# Altium project PCB_Project3.PrjPCB
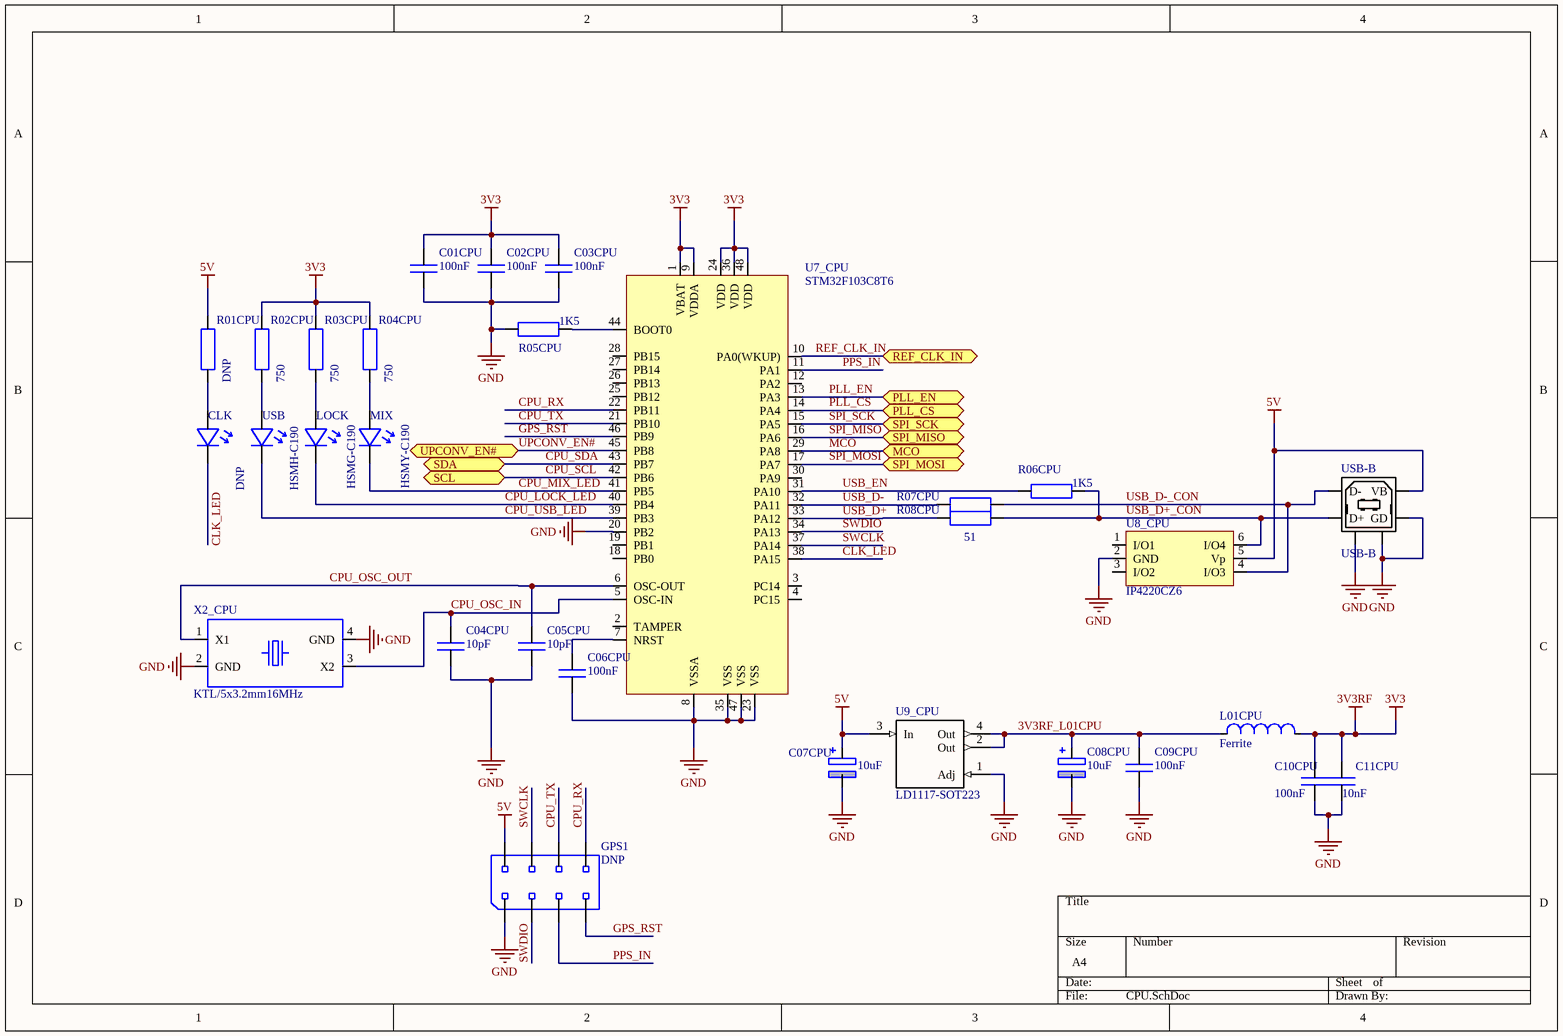
[diagram p0: CPU.SchDoc]
3 sheets, 155 parts. Net scope: flat (ports and power ports of the same name join across sheets).
Board file: Template2.PcbDoc
Sheets:
  CPU.SchDoc
  LO.SchDoc
  Mixer.SchDoc

## Sheet CPU.SchDoc
size A4

### Parts
C01CPU  100nF  [smd C0603_0.80]
C02CPU  100nF  [smd C0603_0.80]
C03CPU  100nF  [smd C0603_0.80]
C04CPU  10pF  [smd C0603_0.80]
C05CPU  10pF  [smd C0603_0.80]
C06CPU  100nF  [smd C0603_0.80]
C07CPU  10uF  [smd C1206 polar]
C08CPU  10uF  [smd C1206 polar]
C09CPU  100nF  [smd C0603_0.80]
C10CPU  100nF  [smd C0603_0.80]
C11CPU  10nF  [smd C0603_0.80]
CLK  DNP  [led HSMH-C190 (Avago Technologies)]
GPS1  DNP  [hdr 2x4]
L01CPU  Ferrite  [smd C0805]
LOCK  HSMG-C190  [led HSMH-C190 (Avago Technologies)]
MIX  HSMY-C190  [led HSMH-C190 (Avago Technologies)]
R01CPU  DNP  [smd C0603_0.45]
R02CPU  750  [smd C0603_0.45]
R03CPU  750  [smd C0603_0.45]
R04CPU  750  [smd C0603_0.45]
R05CPU  1K5  [smd C0603_0.45]
R06CPU  1K5  [smd C0603_0.45]
R07CPU  51  [smd C0603_0.45]  (value not drawn)
R08CPU  51  [smd C0603_0.45]
U7_CPU  STM32F103C8T6  [TSQFP50P900X900X160-48N]
U8_CPU  IP4220CZ6  [smd SOT-457]
U9_CPU  LD1117-SOT223  [SOT223]
USB  HSMH-C190  [led HSMH-C190 (Avago Technologies)]
USB-B  USB-B  [USB-B]
X2_CPU  KTL/5x3.2mm16MHz  [smd KTL 5x3.2]

### Ports
MCO, PLL_CS, PLL_EN, REF_CLK_IN, SCL, SDA, SPI_MISO, SPI_MOSI, SPI_SCK, UPCONV_EN#

### Nets
3V3: C01CPU.2 C02CPU.2 C03CPU.2 C10CPU.2 C11CPU.2 L01CPU.2 R02CPU.2 R03CPU.2 R04CPU.2 U7_CPU.1(VBAT) U7_CPU.9(VDDA) U7_CPU.24(VDD) U7_CPU.36(VDD) U7_CPU.48(VDD)  [also labelled 3V3RF]
5V: C07CPU.1 GPS1.2 R01CPU.2 U8_CPU.5(Vp) U9_CPU.3(In) USB-B.1(VB)
GND: C01CPU.1 C02CPU.1 C03CPU.1 C04CPU.1 C05CPU.1 C06CPU.1 C07CPU.2 C08CPU.2 C09CPU.1 C10CPU.1 C11CPU.1 GPS1.1 R05CPU.1 U7_CPU.8(VSSA) U7_CPU.20(PB2) U7_CPU.23(VSS) U7_CPU.35(VSS) U7_CPU.47(VSS) U8_CPU.2(GND) U9_CPU.1(Adj) USB-B.4(GD) USB-B.5 USB-B.6 X2_CPU.2(GND) X2_CPU.4(GND)
3V3RF_L01CPU: C08CPU.1 C09CPU.2 L01CPU.1 U9_CPU.2(Out) U9_CPU.4(Out)
CLK_LED: CLK.2 U7_CPU.38(PA15)
CPU_LOCK_LED: LOCK.2 U7_CPU.40(PB4)
CPU_MIX_LED: MIX.2 U7_CPU.41(PB5)
CPU_OSC_IN: C04CPU.2 U7_CPU.5(OSC-IN) X2_CPU.3(X2)
CPU_OSC_OUT: C05CPU.2 U7_CPU.6(OSC-OUT) X2_CPU.1(X1)
CPU_RX: GPS1.8 U7_CPU.22(PB11)
CPU_SCL: U7_CPU.42(PB6) ; port SCL
CPU_SDA: U7_CPU.43(PB7) ; port SDA
CPU_TX: GPS1.6 U7_CPU.21(PB10)
CPU_USB_LED: U7_CPU.39(PB3) USB.2
GPS_RST: GPS1.7 U7_CPU.46(PB9)
MCO: U7_CPU.29(PA8) ; port MCO
PLL_CS: U7_CPU.14(PA4) ; port PLL_CS  [project net CS_PLL]
PLL_EN: U7_CPU.13(PA3) ; port PLL_EN
PPS_IN: GPS1.5 U7_CPU.11(PA1)
REF_CLK_IN: U7_CPU.10(PA0(WKUP)) ; port REF_CLK_IN
SPI_MISO: U7_CPU.16(PA6) ; port SPI_MISO
SPI_MOSI: U7_CPU.17(PA7) ; port SPI_MOSI
SPI_SCK: U7_CPU.15(PA5) ; port SPI_SCK
SWCLK: GPS1.4 U7_CPU.37(PA14)
SWDIO: GPS1.3 U7_CPU.34(PA13)
UPCONV_EN#: U7_CPU.45(PB8) ; port UPCONV_EN#
USB_D+: R08CPU.1 U7_CPU.33(PA12)
USB_D+_CON: R06CPU.2 R08CPU.2 U8_CPU.6(I/O4) USB-B.3(D+)
USB_D-: R07CPU.1 U7_CPU.32(PA11)
USB_D-_CON: R07CPU.2 U8_CPU.4(I/O3) USB-B.2(D-)
USB_EN: R06CPU.1 U7_CPU.31(PA10)
NetC06CPU_2: C06CPU.2 U7_CPU.7(NRST)
NetCLK_1: CLK.1 R01CPU.1
NetLOCK_1: LOCK.1 R03CPU.1
NetMIX_1: MIX.1 R04CPU.1
NetR02CPU_1: R02CPU.1 USB.1
NetR05CPU_2: R05CPU.2 U7_CPU.44(BOOT0)

Not connected (* = marked no-connect by the designer): U7_CPU 2(TAMPER) 3(PC14) 4(PC15) 12(PA2) 18(PB0) 19(PB1) 25(PB12) 26(PB13) 27(PB14) 28(PB15) 30(PA9); U8_CPU 1(I/O1) 3(I/O2)

### Library data of the parts
C01CPU C02CPU C03CPU C06CPU C09CPU C10CPU C11CPU = CSMD603/100nF: smd capaciteit, verp.0603, 100nF; Part Number: CSMD603/100nF; Component Kind: Standard; Component Type: Standard; Designator: CSMD603/100nF; Pin Count: 2; Supplier 1: Farnell
C04CPU C05CPU = CSMD603/10pF: smd capaciteit, verp.0603, 10pF; Part Number: CSMD603/10pF; Component Kind: Standard; Component Type: Standard; Designator: CSMD603/10pF; Pin Count: 2; Supplier 1: Farnell
C07CPU C08CPU = CSMD1206/10uF/10V: smd capaciteit, tantalium, verp.1206, 10uF/10V; Part Number: CSMD1206/10uF/10V; Component Kind: Standard; Component Type: Standard; Designator: CSMD1206/10uF/10V; Pin Count: 2; Supplier 1: Farnell
CLK USB = HSMH-C190: led smd rood, Avago Techn., HSMH-C190; Supplier 1: Farnell
GPS1 = CON HDR 2x4: pcb header recht 2x4  pitch 100mil; Part Number: CON HDR 2x4; Component Kind: Standard; Component Type: Standard; Designator: CON HDR 2x4; Pin Count: 8; Supplier 1: Farnell
L01CPU = Ferrite 0805: Ferrite bead, 0805 package; Supplier 1: Farnell
LOCK = HSMG-C190: led smd groen, Avago Techn., HSMG-C190; Supplier 1: Farnell
MIX = HSMY-C190: led smd geel, Avago Techn., HSMY-C190; Supplier 1: Farnell
R01CPU R02CPU R03CPU R04CPU = 470R/603: weerstand SMD603, 470R; Supplier 1: Farnell
R05CPU R06CPU = 1K5/603: weerstand SMD603, 1K5; Supplier 1: Farnell
R07CPU R08CPU = 22R/603: weerstand SMD603, 22R; Supplier 1: Farnell
U7_CPU = STM32F100xx
U8_CPU = IP4220CZ6: Dual USB 2.0 integrated ESD protection; Supplier 1: Farnell
USB-B = USB-B: USB B DEVICE CONNECTOR; Text Field1: Assmann; Text Field2: AU-Y1007; Text Field3: Digi-Key; Text Field4: AE1085-ND; Text Field5: Thru-Hole; Text Field6: 1.168; NI?: *; O?: *; Section:: *
X2_CPU = KTL/5x3.2mm 16MHz: TXC Xtal 16.000 MHz, 5x3.2mm; Part Number: KTL/5x3.2mm 16MHz; Component Kind: Standard; Component Type: Standard; Designator: KTL/5x3.2mm 16MHz; Pin Count: 4; Supplier 1: Farnell

## Sheet LO.SchDoc
size A4
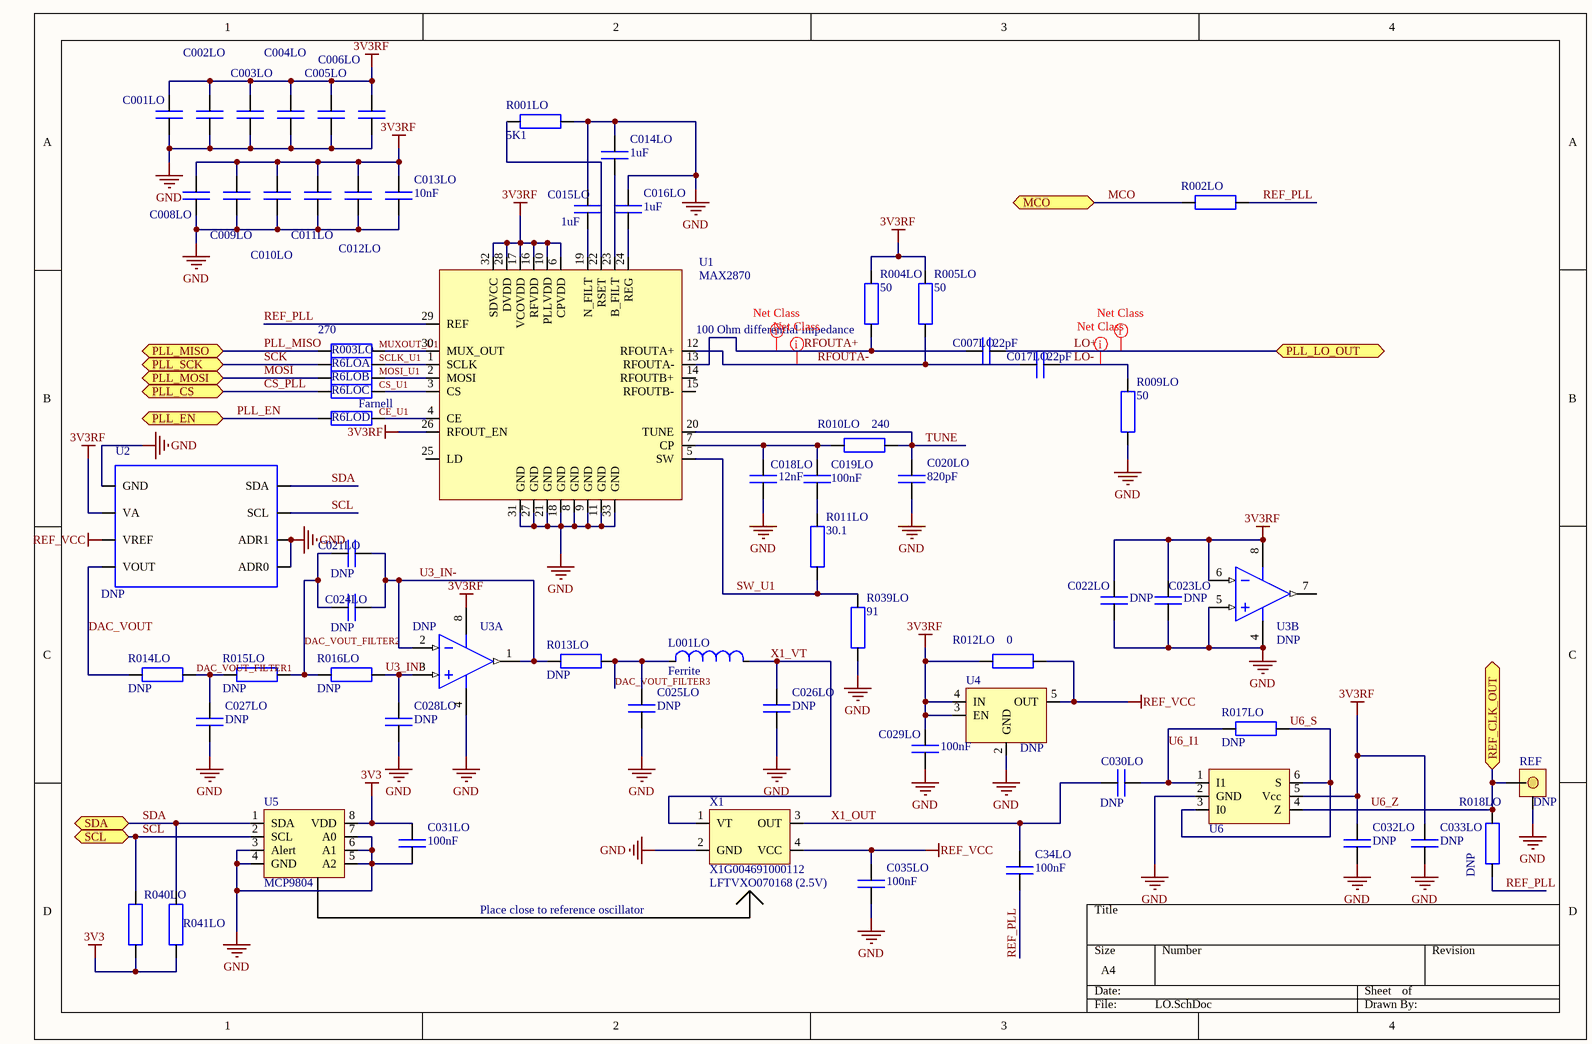
[diagram p1: LO.SchDoc]

### Parts
C001LO  100nF  [smd C0603_0.80]  (value not drawn)
C002LO  100nF  [smd C0603_0.80]  (value not drawn)
C003LO  100nF  [smd C0603_0.80]  (value not drawn)
C004LO  100nF  [smd C0603_0.80]  (value not drawn)
C005LO  100nF  [smd C0603_0.80]  (value not drawn)
C006LO  100nF  [smd C0603_0.80]  (value not drawn)
C007LO  22pF  [smd C0402]
C008LO  10nF  [smd C0402]  (value not drawn)
C009LO  10nF  [smd C0402]  (value not drawn)
C010LO  10nF  [smd C0402]  (value not drawn)
C011LO  10nF  [smd C0402]  (value not drawn)
C012LO  10nF  [smd C0402]  (value not drawn)
C013LO  10nF  [smd C0402]
C014LO  1uF  [smd C0603_0.80]
C015LO  1uF  [smd C0603_0.80]
C016LO  1uF  [smd C0603_0.80]
C017LO  22pF  [smd C0402]
C018LO  12nF  [smd C0603_0.80]
C019LO  100nF  [smd C0603_0.80]
C020LO  820pF  [smd C0603_0.80]
C021LO  DNP  [smd C0805_1.30]
C022LO  DNP  [smd C0402]
C023LO  DNP  [smd C0603_0.80]
C024LO  DNP  [smd C0805_1.30]
C025LO  DNP  [smd C0805_0.60]
C026LO  DNP  [smd C0805_0.60]
C027LO  DNP  [smd C0805_1.30]
C028LO  DNP  [smd C0805_0.60]
C029LO  100nF  [smd C0603_0.80]
C030LO  DNP  [smd C0603_0.80]
C031LO  100nF  [smd C0603_0.80]
C032LO  DNP  [smd C0603_0.80]
C033LO  DNP  [smd C0603_0.80]
C34LO  100nF  [smd C0603_0.80]
C035LO  100nF  [smd C0603_0.80]
L001LO  Ferrite  [smd C0805]
R001LO  5K1  [smd C0603_0.45]
R002LO  (no value)  [smd C0805_0.50]
R003LO  270  [smd C0805_0.50]
R004LO  50  [smd C0402_0.35]
R005LO  50  [smd C0402_0.35]
R6LO  DNP  [smd R EXB38v]  (value not drawn)  (parts A,B,C,D of 4)
R009LO  50  [smd C0402_0.35]
R010LO  240  [smd C0603_0.45]
R011LO  30.1  [smd C0603_0.45]
R012LO  0  [smd C0805_0.50]
R013LO  DNP  [smd C0603_0.45]
R014LO  DNP  [smd C0603_0.45]
R015LO  DNP  [smd C0603_0.45]
R016LO  DNP  [smd C0603_0.45]
R017LO  DNP  [smd C0603_0.45]
R018LO  DNP  [smd C0805_0.50]
R039LO  91  [smd C0603_0.45]
R040LO  (no value)  [smd C0805_0.50]
R041LO  (no value)  [smd C0805_0.50]
REF  DNP  [smd U.FL]
U1  MAX2870  [MAXIM-T3255]
U2  DNP  [smd MSOP/8]
U3  DNP  [smd soicn/8]  (parts A,B of 2)
U4  DNP  [SO23-5 TI]
U5  MCP9804  [smd MSOP/8]
U6  DNP  [SMD SC-70 (6-pin)]  (value not drawn)
X1  X1G004691000112  [X1G004691000112]

### Ports
MCO, PLL_CS, PLL_EN, PLL_LO_OUT, PLL_MISO, PLL_MOSI, PLL_SCK, REF_CLK_OUT, SCL, SDA

### Nets
3V3: C001LO.2 C002LO.2 C003LO.2 C004LO.2 C005LO.2 C006LO.2 C008LO.2 C009LO.2 C010LO.2 C011LO.2 C012LO.2 C013LO.2 C022LO.2 C023LO.2 C029LO.2 C031LO.2 C032LO.2 C033LO.2 R004LO.2 R005LO.2 R012LO.1 R040LO.2 R041LO.1 U1.6(CPVDD) U1.10(PLLVDD) U1.16(RFVDD) U1.17(VCOVDD) U1.26(RFOUT_EN) U1.28(DVDD) U1.32(SDVCC) U2.6(VA) U3.6(IN-) U3.8(V+) U4.3(EN) U4.4(IN) U5.8(VDD) U6.5(Vcc)  [also labelled 3V3RF]
GND: C001LO.1 C002LO.1 C003LO.1 C004LO.1 C005LO.1 C006LO.1 C008LO.1 C009LO.1 C010LO.1 C011LO.1 C012LO.1 C013LO.1 C014LO.1 C015LO.1 C016LO.1 C018LO.1 C020LO.1 C022LO.1 C023LO.1 C025LO.1 C026LO.1 C027LO.1 C028LO.1 C029LO.1 C031LO.1 C032LO.1 C033LO.1 C035LO.1 R001LO.1 R009LO.1 R039LO.1 REF.0 U1.8(GND) U1.9(GND) U1.11(GND) U1.18(GND) U1.21(GND) U1.27(GND) U1.31(GND) U1.33(GND) U2.1(ADR0) U2.2(ADR1) U2.5(GND) U3.4(V-) U3.5(IN+) U4.2(GND) U5.3(Alert) U5.4(GND) U5.5(A2) U5.6(A1) U5.7(A0) U6.2(GND) X1.2(GND)
REF_VCC: C035LO.2 R012LO.2 U2.7(VREF) U4.5(OUT) X1.4(VCC)
CS_PLL: R6LO.5 ; port PLL_CS
DAC_VOUT: R014LO.1 U2.8(VOUT)
DAC_VOUT_FILTER1: C027LO.2 R014LO.2 R015LO.1
DAC_VOUT_FILTER2: C021LO.2 C024LO.2 R015LO.2 R016LO.1
DAC_VOUT_FILTER3: C025LO.2 L001LO.1 R013LO.2
LO+: C007LO.2 ; port PLL_LO_OUT
LO-: C017LO.2 R009LO.2
MCO: R002LO.2 ; port MCO
MOSI: R6LO.3 ; port PLL_MOSI
PLL_EN: R6LO.7 ; port PLL_EN
PLL_MISO: R003LO.1 ; port PLL_MISO
REF_PLL: C34LO.2 R002LO.1 R018LO.1 U1.29(REF)
RFOUTA+: C007LO.1 R004LO.1 U1.13(RFOUTA-)
RFOUTA-: C017LO.1 R005LO.1 U1.12(RFOUTA+)
SCK: R6LO.1 ; port PLL_SCK
SCL: R040LO.1 U2.3(SCL) U5.2(SCL) ; port SCL  [project net CPU_SCL]
SDA: R041LO.2 U2.4(SDA) U5.1(SDA) ; port SDA  [project net CPU_SDA]
SW_U1: R011LO.1 R039LO.2 U1.5(SW)
TUNE: C020LO.2 R010LO.2 U1.20(TUNE)
U3_IN-: C021LO.1 C024LO.1 R013LO.1 U3.1(OUT) U3.2(IN-)
U3_INP: C028LO.2 R016LO.2 U3.3(IN+)
U6_I1: C030LO.1 R017LO.1 U6.1(I1)
U6_S: R017LO.2 U6.3(I0) U6.6(S)
U6_Z: R018LO.2 REF.1 U6.4(Z) ; port REF_CLK_OUT
X1_OUT: C030LO.2 C34LO.1 X1.3(OUT)
X1_VT: C026LO.2 L001LO.2 X1.1(VT)
NetC014LO_2: C014LO.2 U1.23(B_FILT)
NetC015LO_2: C015LO.2 U1.19(N_FILT)
NetC016LO_2: C016LO.2 U1.24(REG)
NetC018LO_2: C018LO.2 C019LO.2 R010LO.1 U1.7(CP)
NetC019LO_1: C019LO.1 R011LO.2
NetR001LO_2: R001LO.2 U1.22(RSET)
NetR003LO_2: R003LO.2 U1.30(MUX_OUT)
NetR6LO_2: R6LO.2 U1.1(SCLK)
NetR6LO_4: R6LO.4 U1.2(MOSI)
NetR6LO_6: R6LO.6 U1.3(CS)
NetR6LO_8: R6LO.8 U1.4(CE)

Not connected (* = marked no-connect by the designer): U1 14(RFOUTB+) 15(RFOUTB-) 25(LD); U3 7(OUT)

### Layout directives
net class RF: LO+, LO-, RFOUTA+, RFOUTA-

### Notes on the sheet
- (near R004LO) 100 Ohm differential impedance
- Place close to reference oscillator
- (near X1) LFTVXO070168 (2.5V)
- Labels drawn without touching a wire or pin: CE_U1, CS_U1, MOSI_U1, MUXOUT_U1, SCLK_U1

### Library data of the parts
C001LO C002LO C003LO C004LO C005LO C006LO C023LO C029LO C030LO C031LO C032LO C033LO C34LO C035LO = CSMD603/100nF: smd capaciteit, verp.0603, 100nF; Part Number: CSMD603/100nF; Component Kind: Standard; Component Type: Standard; Designator: CSMD603/100nF; Pin Count: 2; Supplier 1: Farnell
C007LO C017LO = CSMD402/22pF: smd capaciteit, verp.0402, 22pF; Part Number: CSMD402/22pF; Component Kind: Standard; Component Type: Standard; Designator: CSMD402/22pF; Pin Count: 2; Supplier 1: Farnell
C008LO C009LO C010LO C011LO C012LO C013LO C022LO = CSMD402/100nF: smd capaciteit, verp.0402, 10nF; Part Number: CSMD402/100nF; Component Kind: Standard; Component Type: Standard; Designator: CSMD402/100nF; Pin Count: 2; Supplier 1: Farnell
C014LO C015LO C016LO = CSMD603/1uF: smd capaciteit, verp.0603, 1uF; Part Number: CSMD603/18nF; Component Kind: Standard; Component Type: Standard; Designator: CSMD603/18nF; Library Reference: CSMD603/18nF; Pin Count: 2
C018LO C019LO C020LO = CSMD603/12nF: smd capaciteit, verp.0603, 12nF; Part Number: CSMD603/12nF; Component Kind: Standard; Component Type: Standard; Designator: CSMD603/12nF; Pin Count: 2
C021LO C024LO C027LO = CSMD805/1uF: smd capaciteit, verp.0805, 1uF
C025LO C026LO C028LO = CSMD805/330nF: smd capaciteit, verp.0805, 330nF; Part Number: CSMD805/330nF; Component Kind: Standard; Component Type: Standard; Designator: CSMD805/330nF; Pin Count: 2
L001LO = Ferrite 0805: Ferrite bead, 0805 package; Supplier 1: Farnell
R001LO = 5K1/603: weerstand SMD603, 5K1
R002LO R003LO R012LO R018LO = 270R/805: weerstand SMD805, 270R
R004LO R005LO R009LO = 47K/402: weerstand SMD402, 47K
R6LO = 22R/Network4/603: weerstandsnetwerk SMD603, 4x 22R; Supplier 1: Farnell
R010LO R011LO R039LO = 240K/603: weerstand SMD603, 240K
R013LO R014LO R015LO R016LO R017LO = 100K/603: weerstand SMD603, 100K; Supplier 1: Farnell
R040LO R041LO = 1K8/805: weerstand SMD805, 1K8
REF = CON HRS/SMA/ U.FL-R-SMT(01): connector Hirose, U.FL serie, U.FL-R-SMT(01); Supplier 1: Farnell
U2 = DAC081C085CIMM/NOPB: 12-Bit Micro Power DAC with I2C interface; Supplier 1: Farnell
U3 = MCP602-E/SN: Dual 2.7V to 6.0V Single Supply CMOS Op Amp
U4 = LM4120
U5 = MCP9804: ±0.25°C Typical Accuracy Digital Temperature Sensor; Supplier 1: Farnell
U6 = NC7SV157P6X: TinyLogic  2-Input Non-Inverting Multiplexer

## Sheet Mixer.SchDoc
size A3
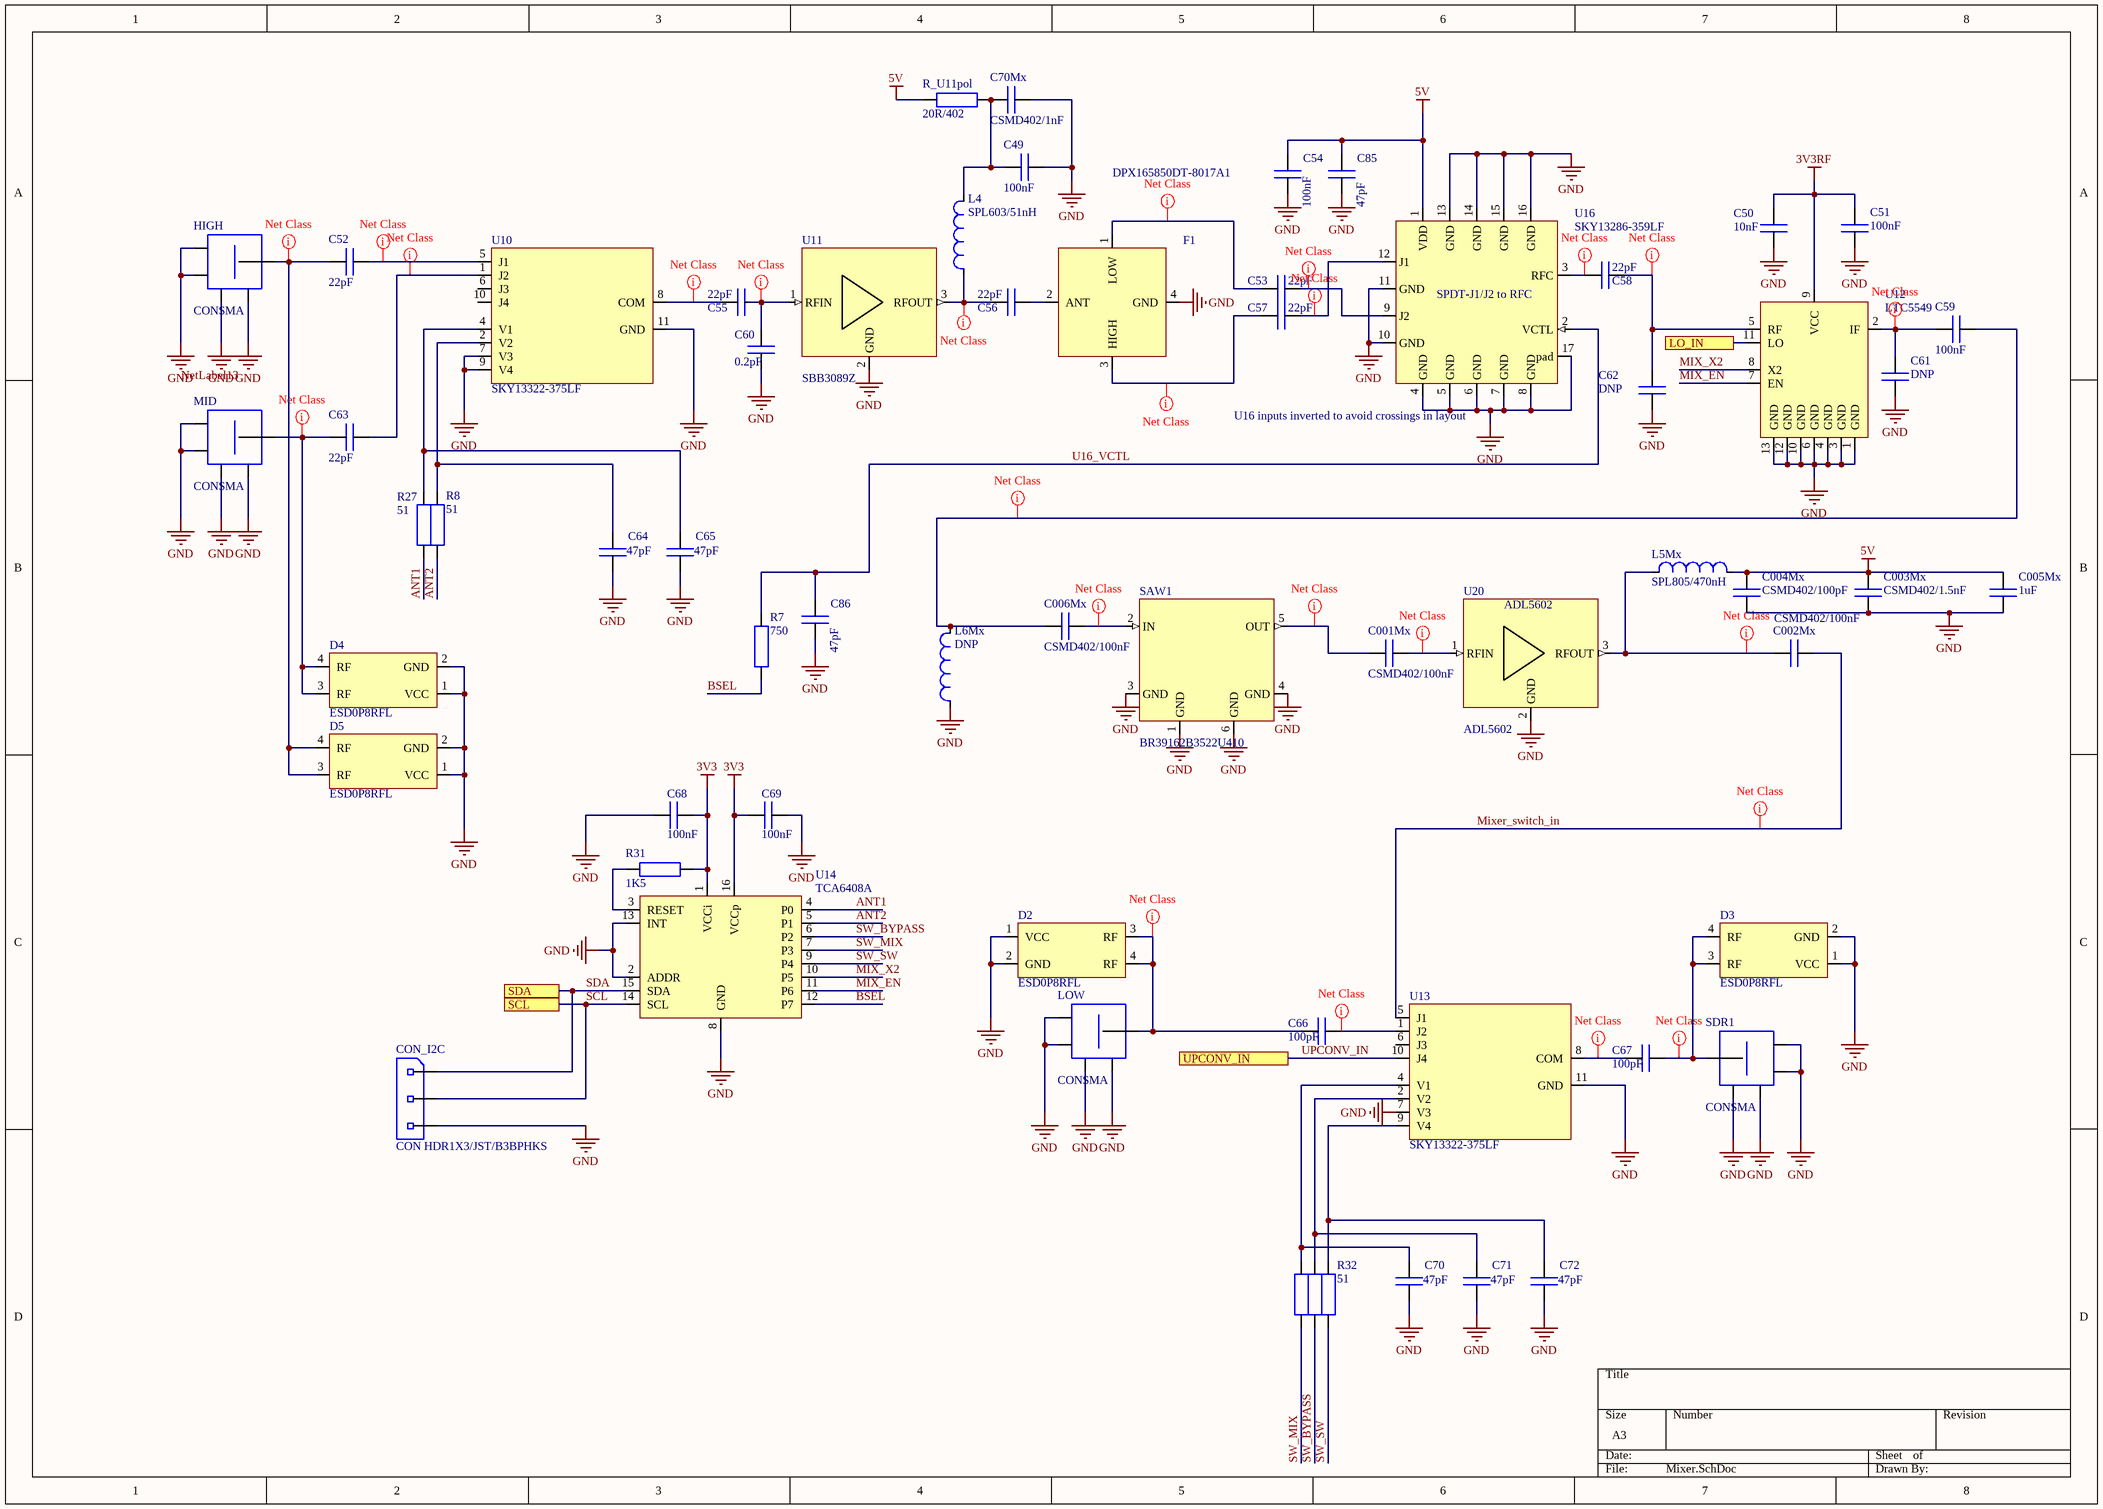
[diagram p2: Mixer.SchDoc]

### Parts
C001Mx  CSMD402/100nF  [smd C0402]
C002Mx  CSMD402/100nF  [smd C0402]
C003Mx  CSMD402/1.5nF  [smd C0402]
C004Mx  CSMD402/100pF  [smd C0402]
C005Mx  1uF  [smd C0603_0.80]
C006Mx  CSMD402/100nF  [smd C0402]
C49  100nF  [smd C0603_0.80]
C50  10nF  [smd C0402]
C51  100nF  [smd C0603_0.80]
C52  22pF  [smd C0402]
C53  22pF  [smd C0402]
C54  100nF  [smd C0603_0.80]
C55  22pF  [smd C0402]
C56  22pF  [smd C0402]
C57  22pF  [smd C0402]
C58  22pF  [smd C0402]
C59  100nF  [smd C0402]
C60  0.2pF  [smd C0402]
C61  DNP  [smd C0402]
C62  DNP  [smd C0402]
C63  22pF  [smd C0402]
C64  47pF  [smd C0603_0.80]
C65  47pF  [smd C0603_0.80]
C66  100pF  [smd C0402]
C67  100pF  [smd C0402]
C68  100nF  [smd C0603_0.80]
C69  100nF  [smd C0603_0.80]
C70  47pF  [smd C0603_0.80]
C70Mx  CSMD402/1nF  [smd C0402]
C71  47pF  [smd C0603_0.80]
C72  47pF  [smd C0603_0.80]
C85  47pF  [smd C0603_0.80]
C86  47pF  [smd C0603_0.80]
CON_I2C  CON HDR1X3/JST/B3BPHKS  [con HDR/BNR1x3 (pitch 2mm, JST B3B-PH-K-S)]
D2  ESD0P8RFL  [ESD0P8RFL]
D3  ESD0P8RFL  [ESD0P8RFL]
D4  ESD0P8RFL  [ESD0P8RFL]
D5  ESD0P8RFL  [ESD0P8RFL]
F1  DPX165850DT-8017A1  [DPX165850DT-8017A1]
HIGH  CONSMA  [con SMA (recht)]
L4  SPL603/51nH  [smd C0603]
L5Mx  SPL805/470nH  [smd C0805]
L6Mx  DNP  [smd C0603]
LOW  CONSMA  [con SMA (recht)]
MID  CONSMA  [con SMA (recht)]
R7  750  [smd C0603_0.45]
R8  51  [smd C0603_0.45]
R27  51  [smd C0603_0.45]
R28  51  [smd C0603_0.45]  (value not drawn)
R30  51  [smd C0603_0.45]  (value not drawn)
R31  1K5  [smd C0805_0.50]
R32  51  [smd C0603_0.45]
R_U11pol  20R/402  [smd C0402_0.35]
SAW1  BR39162B3522U410  [SAW_package]
SDR1  CONSMA  [con SMA (recht)]
U10  SKY13322-375LF  [QFN50P200X300X80-10N]
U11  SBB3089Z  [SB3089Z_footprint]
U12  LTC5549  [LTC5549]
U13  SKY13322-375LF  [QFN50P200X300X80-10N]
U14  TCA6408A  [TSOP65P640X100-16M]
U16  SKY13286-359LF  [QFN-16_skyworks]
U20  ADL5602  [LFCSP]

### Ports
LO_IN, SCL, SDA, UPCONV_IN

### Nets
3V3: C50.2 C51.2 C68.2 C69.1 R31.1 U12.9(VCC) U14.1(VCCi) U14.16(VCCp)  [also labelled 3V3RF]
5V: C003Mx.1 C004Mx.1 C005Mx.2 C54.2 C85.2 L5Mx.2 R_U11pol.1 U16.1(VDD)
GND: C003Mx.2 C004Mx.2 C005Mx.1 C49.1 C50.1 C51.1 C54.1 C60.1 C61.1 C62.1 C64.1 C65.1 C68.1 C69.2 C70.1 C70Mx.2 C71.1 C72.1 C85.1 C86.1 CON_I2C.3 D2.1(VCC) D2.2(GND) D3.1(VCC) D3.2(GND) D4.1(VCC) D4.2(GND) D5.1(VCC) D5.2(GND) F1.4(GND) HIGH.2 HIGH.3 HIGH.4 HIGH.5 L6Mx.1 LOW.2 LOW.3 LOW.4 LOW.5 MID.2 MID.3 MID.4 MID.5 SAW1.1(GND) SAW1.3(GND) SAW1.4(GND) SAW1.6(GND) SDR1.2 SDR1.3 SDR1.4 SDR1.5 U10.7(V3) U10.9(V4) U10.11(GND) U11.2(GND) U12.1(GND) U12.3(GND) U12.4(GND) U12.6(GND) U12.10(GND) U12.12(GND) U12.13(GND) U13.7(V3) U13.11(GND) U14.2(ADDR) U14.8(GND) U14.13(INT) U16.4(GND) U16.5(GND) U16.6(GND) U16.7(GND) U16.8(GND) U16.10(GND) U16.11(GND) U16.13(GND) U16.14(GND) U16.15(GND) U16.16(GND) U16.17(pad) U20.2(GND)
ANT1: R27.2 U14.4(P0)
ANT2: R8.1 U14.5(P1)
BSEL: R7.1 U14.12(P7)
MIX_EN: U12.7(EN) U14.11(P6)
MIX_X2: U12.8(X2) U14.10(P5)
Mixer_switch_in: C002Mx.2 U13.5(J1)
SCL: CON_I2C.2 U14.14(SCL) ; port SCL  [project net CPU_SCL]
SDA: CON_I2C.1 U14.15(SDA) ; port SDA  [project net CPU_SDA]
SW_BYPASS: R30.1 U14.6(P2)
SW_MIX: R28.1 U14.7(P3)
SW_SW: R32.1 U14.9(P4)
U16_VCTL: C86.2 R7.2 U16.2(VCTL)
UPCONV_IN: U13.10(J4) ; port UPCONV_IN
NetC001Mx_1: C001Mx.1 SAW1.5(OUT)
NetC001Mx_2: C001Mx.2 U20.1(RFIN)
NetC002Mx_1: C002Mx.1 L5Mx.1 U20.3(RFOUT)
NetC006Mx_1: C006Mx.1 C59.2 L6Mx.2
NetC006Mx_2: C006Mx.2 SAW1.2(IN)
NetC49_2: C49.2 C70Mx.1 L4.2 R_U11pol.2
NetC52_1: C52.1 U10.5(J1)
NetC52_2: C52.2 D5.3(RF) D5.4(RF) HIGH.1
NetC53_1: C53.1 F1.1(LOW)
NetC53_2: C53.2 U16.9(J2)
NetC55_1: C55.1 U10.8(COM)
NetC55_2: C55.2 C60.2 U11.1(RFIN)
NetC56_1: C56.1 L4.1 U11.3(RFOUT)
NetC56_2: C56.2 F1.2(ANT)
NetC57_1: C57.1 F1.3(HIGH)
NetC57_2: C57.2 U16.12(J1)
NetC58_1: C58.1 U16.3(RFC)
NetC58_2: C58.2 C62.2 U12.5(RF)
NetC59_1: C59.1 C61.2 U12.2(IF)
NetC63_1: C63.1 U10.1(J2)
NetC63_2: C63.2 D4.3(RF) D4.4(RF) MID.1
NetC64_2: C64.2 R8.2 U10.2(V2)
NetC65_2: C65.2 R27.1 U10.4(V1)
NetC66_1: C66.1 D2.3(RF) D2.4(RF) LOW.1
NetC66_2: C66.2 U13.1(J2)
NetC67_1: C67.1 U13.8(COM)
NetC67_2: C67.2 D3.3(RF) D3.4(RF) SDR1.1
NetC70_2: C70.2 R28.2 U13.4(V1)
NetC71_2: C71.2 R30.2 U13.2(V2)
NetC72_2: C72.2 R32.2 U13.9(V4)
NetR31_2: R31.2 U14.3(RESET)
NetU12_11: U12.11(LO) ; port LO_IN

Not connected (* = marked no-connect by the designer): U10 6(J3) 10(J4); U13 6(J3)

### Layout directives
net class RF: Mixer_switch_in, NetC001Mx_1, NetC001Mx_2, NetC002Mx_1, NetC006Mx_1, NetC006Mx_2, NetC52_1, NetC52_2, NetC53_1, NetC53_2, NetC55_1, NetC55_2, NetC56_1, NetC57_1, NetC57_2, NetC58_1, NetC58_2, NetC59_1, NetC63_1, NetC63_2, NetC66_1, NetC66_2, NetC67_1, NetC67_2

### Notes on the sheet
- (near U16) U16 inputs inverted to avoid crossings in layout
- Labels drawn without touching a wire or pin: NetLabel13
- (in symbol SKY13286-359LF) SPDT-J1/J2 to RFC

### Library data of the parts
C001Mx C002Mx C006Mx C59 = CSMD402/100nF: smd capaciteit, verp.0402, 100nF; Part Number: CSMD402/100nF; Component Kind: Standard; Component Type: Standard; Pin Count: 2; Supplier 1: Farnell
  C001Mx C002Mx C006Mx: Designator: CSMD402/100nF
C003Mx = CSMD402/1.5nF: smd capaciteit, verp.0402, 1.5nF; Part Number: CSMD402/1.5nF; Component Kind: Standard; Component Type: Standard; Designator: CSMD402/1.5nF; Pin Count: 2; Supplier 1: Farnell
C004Mx = CSMD402/100pF: smd capaciteit, verp.0402, 100pF; Part Number: CSMD402/100pF; Component Kind: Standard; Component Type: Standard; Designator: CSMD402/100pF; Pin Count: 2; Supplier 1: Farnell
C005Mx = CSMD603/1uF: as C014LO on sheet LO; Component Kind: Standard; Component Type: Standard; Designator: CSMD603/18nF; Library Reference: CSMD603/18nF; Pin Count: 2; Supplier 1: Farnell
C49 C51 C54 C68 C69 = CSMD603/100nF: smd capaciteit, verp.0603, 100nF; Part Number: CSMD603/100nF; Component Kind: Standard; Component Type: Standard; Designator: CSMD603/100nF; Pin Count: 2
  C49 C51 C54: Supplier 1: Farnell
C50 = CSMD402/100nF: smd capaciteit, verp.0402, 10nF; Part Number: CSMD402/100nF; Component Kind: Standard; Component Type: Standard; Designator: CSMD402/100nF; Pin Count: 2; Supplier 1: Farnell
C52 C53 C55-C58 C60-C63 C66 C67 = CSMD402/22pF: smd capaciteit, verp.0402, 22pF; Part Number: CSMD402/22pF; Component Kind: Standard; Component Type: Standard; Designator: CSMD402/22pF; Pin Count: 2; Supplier 1: Farnell
C64 C65 C70-C72 C85 C86 = CSMD603/100pF: smd capaciteit, verp.0603, 100pF; Part Number: CSMD603/100pF; Component Kind: Standard; Component Type: Standard; Designator: CSMD603/100pF; Pin Count: 2; Supplier 1: Farnell
C70Mx = CSMD402/1nF: smd capaciteit, verp.0402, 1nF; Part Number: CSMD402/1nF; Component Kind: Standard; Component Type: Standard; Designator: CSMD402/1nF; Pin Count: 2; Supplier 1: Farnell
CON_I2C = CON HDR1X3/JST/B3BPHKS: header 1x3, JST B3B-PH-K-S; Part Number: CON HDR1X3/JST/B3BPHKS; Component Kind: Standard; Component Type: Standard; Designator: CON HDR1X3/JST/B3BPHKS; Pin Count: 3; Supplier 1: Farnell
HIGH LOW MID SDR1 = CON SMA: SMA connector, rechtop; Part Number: CON SMA; Component Kind: Standard; Component Type: Standard; Designator: CON SMA; Pin Count: 5; Supplier 1: Farnell
L5Mx = SPL805/470nH: smd spoel, verpakking 805, 470nH; Component Kind: Standard; Supplier 1: Farnell
L6Mx = SPL603/82nH: Manufacturer part number: 0603CS-82NXGLW; Component Kind: Standard; Supplier 1: Mouser; Supplier Part Number 1: 994-0603CS-82NXGLW; Series: https://www.coilcraft.com/0603cs.cfm
R7 R8 R27 R28 R30 R32 = 750R/603: weerstand SMD603, 750R; Supplier 1: Farnell
R31 = 1K8/805: weerstand SMD805, 1K8
R_U11pol = 20R/402: weerstand SMD402, 20R; Supplier 1: Farnell
SAW1 = BR39162B3522U410: Saw Filter; Manufacturer part number: B39162B3522U410; Manufacturer: TDK
U11 = SBB3089Z: RF Amplifier; Manufacturer: rfmd/Qorvo; MPN: SBB3089ZSR
U16 = SKY13286-359LF: SPDT-J2/J1 to RFC; Manufacturer: Skyworks
U20 = ADL5602: Gain block; Manufacturer part number: ADL5602ARKZ-R7; Manufacturer: Analog Devices
L4 = SPL603/51nH: Component Kind: Standard; Supplier 1: Farnell

## Nets that join several sheets
3V3: CPU (14 pins), LO (37 pins), Mixer (8 pins)
5V: CPU (6 pins), Mixer (8 pins)
GND: CPU (25 pins), LO (53 pins), Mixer (80 pins)
CPU_SCL: CPU (U7_CPU.42), LO (R040LO.1 U2.3 U5.2), Mixer (CON_I2C.2 U14.14)
CPU_SDA: CPU (U7_CPU.43), LO (R041LO.2 U2.4 U5.1), Mixer (CON_I2C.1 U14.15)
CS_PLL: CPU (U7_CPU.14), LO (R6LO.5)
MCO: CPU (U7_CPU.29), LO (R002LO.2)
PLL_EN: CPU (U7_CPU.13), LO (R6LO.7)